# Altium schematic sheet Node.SchDoc
size Letter
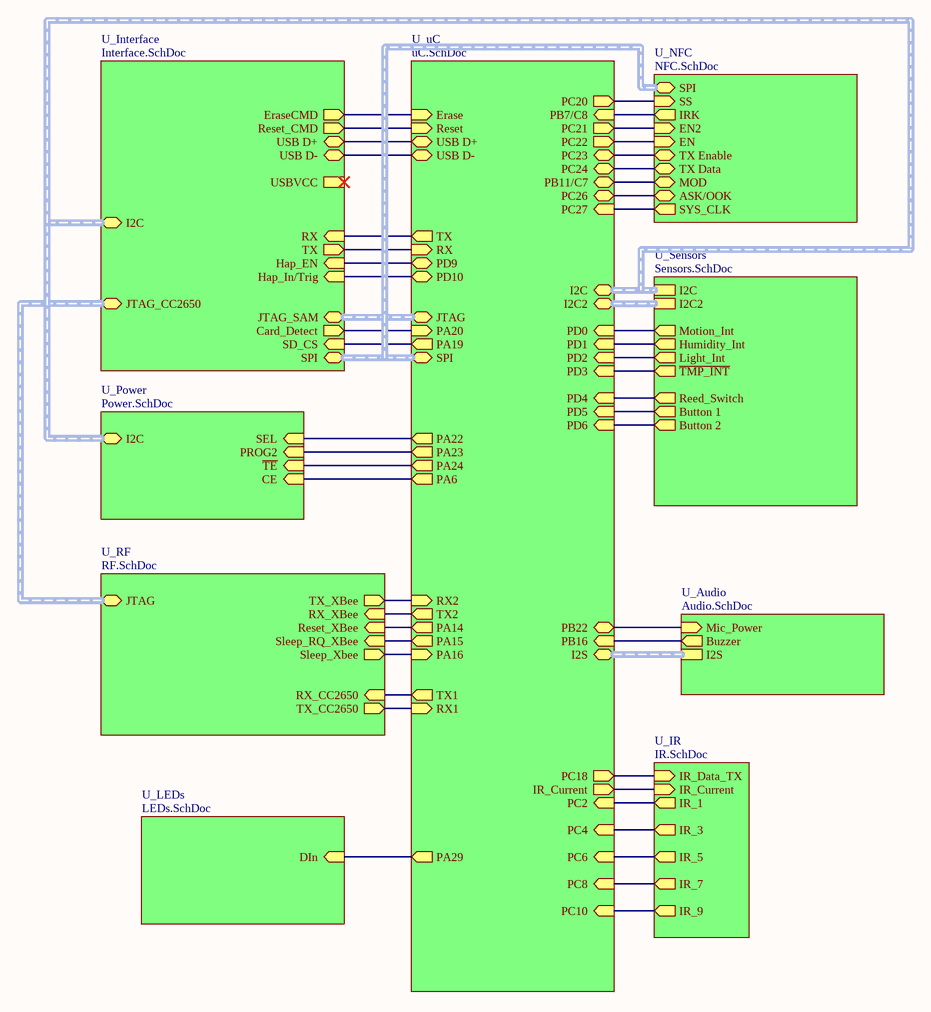
[diagram p0: Node.SchDoc]

## Sub-sheets
U_Audio = Audio.SchDoc: Mic_Power (in), Buzzer (out), I2S (harness I2S)
U_Interface = Interface.SchDoc: USB D+ (bidir), USB D- (bidir), EraseCMD (out), Reset_CMD (out), USBVCC, Card_Detect (out), SD_CS (in), Hap_EN (in), Hap_In/Trig (in), SPI (harness SPI), JTAG_SAM (harness JTAG), JTAG_CC2650 (harness JTAG), I2C (harness I2C), RX (in), TX (out)
U_IR = IR.SchDoc: IR_1 (out), IR_3 (out), IR_5 (out), IR_7 (out), IR_9 (out), IR_Data_TX (in), IR_Current (in)
U_LEDs = LEDs.SchDoc: DIn (in)
U_NFC = NFC.SchDoc: MOD (bidir), IRK (out), ASK/OOK (bidir), SYS_CLK (out), EN2 (in), EN (in), TX Enable (bidir), TX Data (bidir), SS (in), SPI (harness SPI)
U_Power = Power.SchDoc: SEL (in), PROG2 (in), ~{TE} (in), CE (in), I2C (harness I2C)
U_RF = RF.SchDoc: RX_CC2650 (in), TX_CC2650 (out), TX_XBee (out), RX_XBee (in), Reset_XBee (in), Sleep_Xbee (out), Sleep_RQ_XBee (in), JTAG (harness JTAG)
U_Sensors = Sensors.SchDoc: Button 1 (out), Motion_Int (out), Humidity_Int (out), Light_Int (out), Reed_Switch (out), Button 2 (out), I2C (harness I2C), I2C2 (harness I2C), ~{TMP_INT} (out)
U_uC = uC.SchDoc: USB D+ (bidir), USB D- (bidir), IR_Current (out), Reset (in), Erase (in), I2C2 (harness I2C), I2C (harness I2C), JTAG (harness JTAG), SPI (harness SPI), I2S (harness I2S), TX (out), TX1 (out), RX (in), TX2 (out), RX1 (in), RX2 (in), PB16 (in), PB22 (bidir), PC4 (in), PC2 (in), PC6 (in), PC8 (in), PC10 (in), PC18 (out), PA20 (in), PA19 (out), PA22 (out), PA23 (out), PA24 (out), PA6 (out), PA29 (out), PC20 (out), PB7/C8 (in), PC22 (out), PC23 (bidir), PC24 (bidir), PB11/C7 (bidir), PC26 (bidir), PC27 (in), PD0 (in), PD1 (in), PD2 (in), PD5 (in), PD6 (in), PD3 (in), PD4 (in), PD9 (bidir), PD10 (bidir), PA15 (out), PA16 (in), PA14 (out), PC21 (out)

## Nets
(unnamed): sheet U_NFC/MOD, sheet U_uC/PB11/C7
(unnamed): sheet U_NFC/IRK, sheet U_uC/PB7/C8
(unnamed): sheet U_NFC/ASK/OOK, sheet U_uC/PC26
(unnamed): sheet U_NFC/SYS_CLK, sheet U_uC/PC27
(unnamed): sheet U_NFC/EN2, sheet U_uC/PC21
(unnamed): sheet U_NFC/EN, sheet U_uC/PC22
(unnamed): sheet U_NFC/TX Enable, sheet U_uC/PC23
(unnamed): sheet U_NFC/TX Data, sheet U_uC/PC24
(unnamed): sheet U_NFC/SS, sheet U_uC/PC20
(unnamed): sheet U_Interface/USB D+, sheet U_uC/USB D+
(unnamed): sheet U_Interface/USB D-, sheet U_uC/USB D-
(unnamed): sheet U_Interface/EraseCMD, sheet U_uC/Erase
(unnamed): sheet U_Interface/Reset_CMD, sheet U_uC/Reset
(unnamed): sheet U_Interface/Card_Detect, sheet U_uC/PA20
(unnamed): sheet U_Interface/SD_CS, sheet U_uC/PA19
(unnamed): sheet U_Interface/Hap_EN, sheet U_uC/PD9
(unnamed): sheet U_Interface/Hap_In/Trig, sheet U_uC/PD10
(unnamed): sheet U_Interface/RX, sheet U_uC/TX
(unnamed): sheet U_Interface/TX, sheet U_uC/RX
(unnamed): sheet U_IR/IR_1, sheet U_uC/PC2
(unnamed): sheet U_IR/IR_3, sheet U_uC/PC4
(unnamed): sheet U_IR/IR_5, sheet U_uC/PC6
(unnamed): sheet U_IR/IR_7, sheet U_uC/PC8
(unnamed): sheet U_IR/IR_9, sheet U_uC/PC10
(unnamed): sheet U_IR/IR_Data_TX, sheet U_uC/PC18
(unnamed): sheet U_IR/IR_Current, sheet U_uC/IR_Current
(unnamed): sheet U_LEDs/DIn, sheet U_uC/PA29
(unnamed): sheet U_Power/SEL, sheet U_uC/PA22
(unnamed): sheet U_Power/PROG2, sheet U_uC/PA23
(unnamed): sheet U_Power/~{TE}, sheet U_uC/PA24
(unnamed): sheet U_Power/CE, sheet U_uC/PA6
(unnamed): sheet U_RF/RX_CC2650, sheet U_uC/TX1
(unnamed): sheet U_RF/TX_CC2650, sheet U_uC/RX1
(unnamed): sheet U_RF/TX_XBee, sheet U_uC/RX2
(unnamed): sheet U_RF/RX_XBee, sheet U_uC/TX2
(unnamed): sheet U_RF/Reset_XBee, sheet U_uC/PA14
(unnamed): sheet U_RF/Sleep_Xbee, sheet U_uC/PA16
(unnamed): sheet U_RF/Sleep_RQ_XBee, sheet U_uC/PA15
(unnamed): sheet U_uC/PB16, sheet U_Audio/Buzzer
(unnamed): sheet U_uC/PB22, sheet U_Audio/Mic_Power
(unnamed): sheet U_uC/PD0, sheet U_Sensors/Motion_Int
(unnamed): sheet U_uC/PD1, sheet U_Sensors/Humidity_Int
(unnamed): sheet U_uC/PD2, sheet U_Sensors/Light_Int
(unnamed): sheet U_uC/PD5, sheet U_Sensors/Button 1
(unnamed): sheet U_uC/PD6, sheet U_Sensors/Button 2
(unnamed): sheet U_uC/PD3, sheet U_Sensors/~{TMP_INT}
(unnamed): sheet U_uC/PD4, sheet U_Sensors/Reed_Switch

## Buses and harness runs
harness sheet U_Audio/I2S = sheet U_uC/I2S
harness sheet U_Interface/I2C = sheet U_Power/I2C = sheet U_Sensors/I2C = sheet U_uC/I2C
harness sheet U_Interface/JTAG_CC2650 = sheet U_RF/JTAG
harness sheet U_Interface/JTAG_SAM = sheet U_uC/JTAG
harness sheet U_Interface/SPI = sheet U_NFC/SPI = sheet U_uC/SPI
harness sheet U_Sensors/I2C2 = sheet U_uC/I2C2

## Notes on the sheet
- Title
- Size:
- Date:
- Letter
- Number:
- Time:
- Revision:
- Sheet
- of
- File: